# EAGLE design Striptease-Teensy4.1-v1.2 (EAGLE 9.6.2)
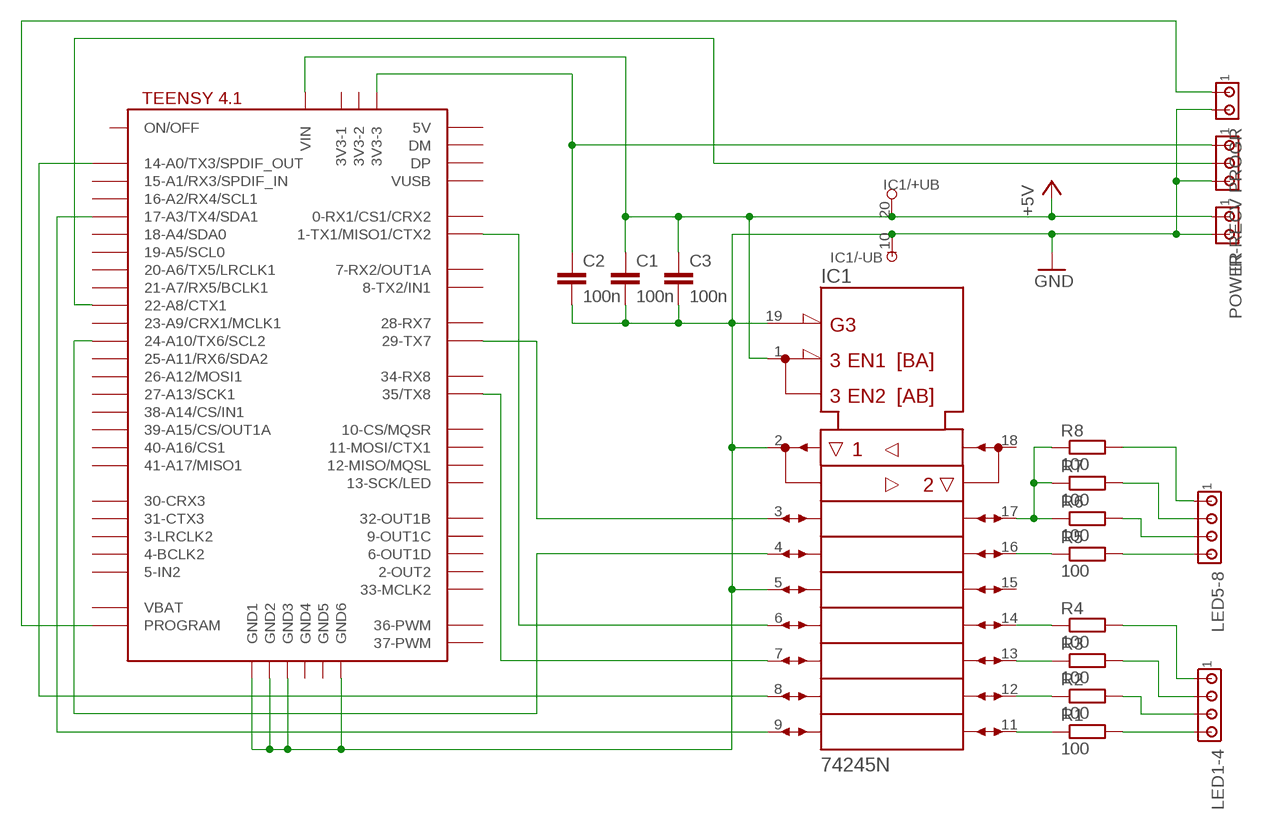
[diagram p0: schematic, sheet 1]

## Parts
C1  100n  C-EU050-025X075  [C050-025X075]
C2  100n  C-EU050-025X075  [C050-025X075]
C3  100n  C-EU050-025X075  [C050-025X075]
IC1  74245N  [DIL20]
IR-RECV  MTA03-100  [10X03MTA]
LED1-4  MTA04-100  [10X04MTA]
LED5-8  MTA04-100  [10X04MTA]
POWER  MTA02-100  [10X02MTA]
PROGR  MTA02-100  [10X02MTA]
R1  100  R-EU_0207/10  [0207/10]
R2  100  R-EU_0207/10  [0207/10]
R3  100  R-EU_0207/10  [0207/10]
R4  100  R-EU_0207/10  [0207/10]
R5  100  R-EU_0207/10  [0207/10]
R6  100  R-EU_0207/10  [0207/10]
R7  100  R-EU_0207/10  [0207/10]
R8  100  R-EU_0207/10  [0207/10]
U$3  TEENSY41-E  [TENNSY41-E]

## Nets
+5V: C1.1 C3.1 IC1.1(DIR) IC1.20(+UB) POWER.1 U$3.VIN
GND: C1.2 C2.2 C3.2 IC1.2(A1) IC1.5(A4) IC1.10(-UB) IC1.19(!G) IR-RECV.3 POWER.2 PROGR.2 U$3.GND1 U$3.GND2 U$3.GND3 U$3.GND6
N$1: C2.1 IR-RECV.1 U$3.3V3-3
N$2: PROGR.1 U$3.PROGRAM
N$3: IC1.16(B3) R5.1
N$6: LED5-8.2 R7.2
N$7: LED1-4.2 R3.2
N$8: LED1-4.3 R2.2
N$9: LED1-4.4 R1.2
N$10: LED5-8.1 R8.2
N$11: IC1.11(B8) R1.1
N$12: IC1.12(B7) R2.1
N$13: IC1.13(B6) R3.1
N$14: IC1.17(B2) R6.1 R7.1 R8.1
N$16: IC1.14(B5) R4.1
N$19: LED1-4.1 R4.2
N$20: LED5-8.4 R5.2
N$22: LED5-8.3 R6.2
N$23: IC1.9(A8) U$3.17-A3/TX4/SDA1
N$24: IC1.8(A7) U$3.14-A0/TX3/SPDIF_OUT
N$25: IC1.7(A6) U$3.35-TX8(35/TX8)
N$26: IC1.6(A5) U$3.1-TX1/MISO1/CTX2
N$27: IC1.4(A3) U$3.24-A10/TX6/SCL2
N$28: IC1.3(A2) U$3.29-TX7
N$31: IR-RECV.2 U$3.22-A8/CTX1
Unconnected: IC1.15(B4) IC1.18(B1) U$3.0-RX1/CS1/CRX2 U$3.2-OUT2 U$3.3-LRCLK2 U$3.3V3-1 U$3.3V3-2 U$3.4-BCLK2 U$3.5-IN2 U$3.6-OUT1D U$3.7-RX2/OUT1A U$3.8-TX2/IN1 U$3.9-OUT1C U$3.10-CS\MQSR(10-CS/MQSR) U$3.11-MOSI/CTX1 U$3.12-MISO/MQSL U$3.13-SCK/LED U$3.15-A1/RX3/SPDIF_IN U$3.16-A2/RX4/SCL1 U$3.18-A4/SDA0 U$3.19-A5/SCL0 U$3.20-A6/TX5/LRCLK1 U$3.21-A7/RX5/BCLK1 U$3.23-A9/CRX1/MCLK1 U$3.25-A11/RX6/SDA2 U$3.26-A12/MOSI1 U$3.27-A13/SCK1 U$3.28-RX7 U$3.30-CRX3 U$3.31-CTX3 U$3.32-OUT1B U$3.33-MCLK2 U$3.34-RX8 U$3.36-PWM U$3.37-PWM U$3.38-A14/CS/IN1 U$3.39-A15/CS/OUT1A U$3.40-A16/CS1 U$3.41-A17/MISO1 U$3.+5V(5V) U$3.DM U$3.DP U$3.GND4 U$3.GND5 U$3.ON/OFF U$3.VBAT U$3.VUSB

## Library data of the parts
C1-C3 = rcl:C-EU: CAPACITOR, European symbol; SPICEPREFIX: C
IC1 = 74ttl-din:74*245: Octal BUS TRANSCEIVER, 3-state
IR-RECV = con-amp:MTA03-100: AMP connector
LED1-4 LED5-8 = con-amp:MTA04-100: AMP connector
POWER PROGR = con-amp:MTA02-100: AMP connector
R1-R8 = rcl:R-EU_: RESISTOR, European symbol; SPICEPREFIX: R
U$3 = teensy:TEENSY41-E

## Board
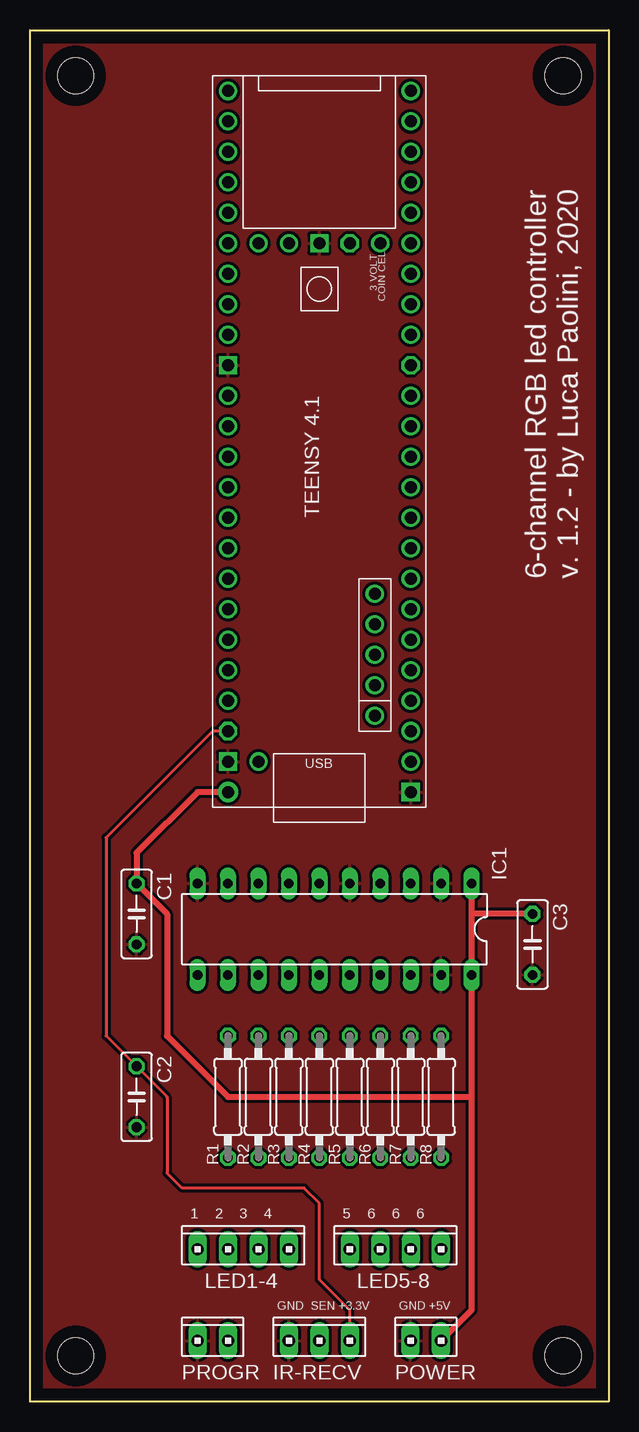
[diagram p1: board, top side]
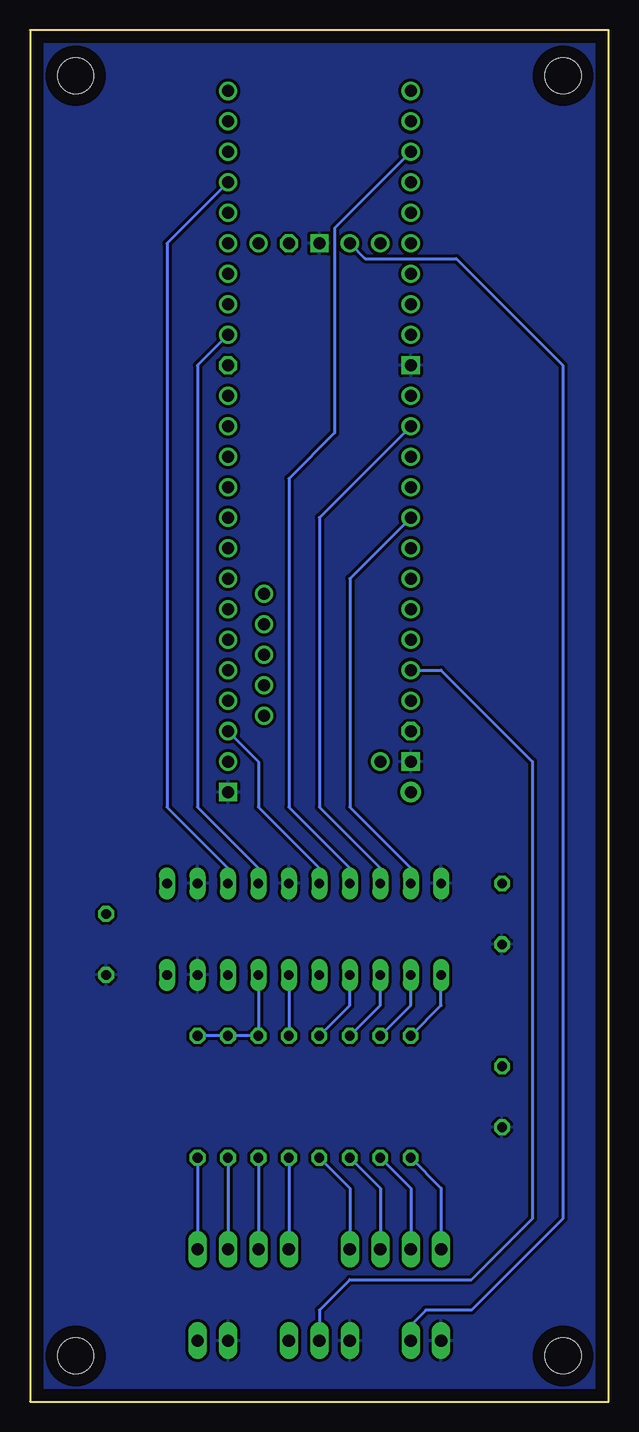
[diagram p2: board, bottom side, seen from below]

Size 48.26 x 114.3 mm. Coordinates in mm from the lower left corner, seen from the top.
Outline: 0,114.3 48.26,114.3 48.26,0 0,0 0,114.3
Copper layers (1*16): Top 0.035mm / dielectric 1.5mm / Bottom 0.035mm
Design rules "default *": minimum track width 6mil, minimum drill 0.35mm, track to track 10mil, track to pad 10mil, pad to pad 10mil, via to via 10mil, smd to smd 6mil, copper to edge 40mil, drill to drill 6mil, minimum pad ring 10mil, minimum via ring 8mil, stop-mask expansion 4mil, vias tented up to drill 0mil, thermal gap 10mil
Holes 3 mm at 44.45,110.49 3.81,110.49 3.81,3.81 44.45,3.81

### Footprints (pad centres in the part's own frame; a part is rotated, then mirrored left to right if it is on the bottom)
C050-025X075 = drill 0.813 octagon: 1 -2.54,0; 2 2.54,0
DIL20 = drill 0.813 long: 1 -11.43,-3.81; 2 -8.89,-3.81; 3 -6.35,-3.81; 4 -3.81,-3.81; 5 -1.27,-3.81; 6 1.27,-3.81; 7 3.81,-3.81; 8 6.35,-3.81; 9 8.89,-3.81; 10 11.43,-3.81; 11 11.43,3.81; 12 8.89,3.81; 13 6.35,3.81; 14 3.81,3.81; 15 1.27,3.81; 16 -1.27,3.81; 17 -3.81,3.81; 18 -6.35,3.81; 19 -8.89,3.81; 20 -11.43,3.81
10X03MTA = drill 1.016 long: 1 2.54,0; 2 0,0; 3 -2.54,0
10X04MTA = drill 1.016 long: 1 3.81,0; 2 1.27,0; 3 -1.27,0; 4 -3.81,0
10X02MTA = drill 1.016 long: 1 1.27,0; 2 -1.27,0
0207/10 = drill 0.813 octagon: 1 -5.08,0; 2 5.08,0
TENNSY41-E = drill 1: 0-RX1/CS1/CRX2 -27.94,-7.62; 1-TX1/MISO1/CTX2 -25.4,-7.62; 2-OUT2 -22.86,-7.62; 3-LRCLK2 -20.32,-7.62; 4-BCLK2 -17.78,-7.62; 5-IN2 -15.24,-7.62; 6-OUT1D -12.7,-7.62; 7-RX2/OUT1A -10.16,-7.62; 8-TX2/IN1 -7.62,-7.62; 9-OUT1C -5.08,-7.62; 10-CS\MQSR -2.54,-7.62; 11-MOSI/CTX1 0,-7.62; 12-MISO/MQSL 2.54,-7.62; 13-SCK/LED 2.54,7.62; 14-A0/TX3/SPDIF_OUT 0,7.62; 15-A1/RX3/SPDIF_IN -2.54,7.62; 16-A2/RX4/SCL1 -5.08,7.62; 17-A3/TX4/SDA1 -7.62,7.62; 18-A4/SDA0 -10.16,7.62; 19-A5/SCL0 -12.7,7.62; 20-A6/TX5/LRCLK1 -15.24,7.62; 21-A7/RX5/BCLK1 -17.78,7.62; 22-A8/CTX1 -20.32,7.62; 23-A9/CRX1/MCLK1 -22.86,7.62; 24-A10/TX6/SCL2 7.62,-7.62; 25-A11/RX6/SDA2 10.16,-7.62; 26-A12/MOSI1 12.7,-7.62; 27-A13/SCK1 15.24,-7.62; 28-RX7 17.78,-7.62; 29-TX7 20.32,-7.62; 30-CRX3 22.86,-7.62; 31-CTX3 25.4,-7.62; 32-OUT1B 27.94,-7.62; 33-MCLK2 27.94,7.62; 34-RX8 25.4,7.62; 35-TX8 22.86,7.62; 36-PWM 20.32,7.62; 37-PWM 17.78,7.62; 38-A14/CS/IN1 15.24,7.62; 39-A15/CS/OUT1A 12.7,7.62; 40-A16/CS1 10.16,7.62; 41-A17/MISO1 7.62,7.62; +5V -24.13,-4.62; DM -21.59,-4.62; DP -19.05,-4.62; GND4 -16.51,-4.62; GND5 -13.97,-4.62; ON/OFF 15.24,5.08; PROGRAM 15.24,2.54; VBAT 15.24,-5.08; VUSB -27.94,5.08 | drill 1 octagon: 3V3-1 5.08,-7.62; 3V3-2 15.24,-2.54; 3V3-3 -25.4,7.62 | drill 1 square: GND1 -30.48,-7.62; GND2 15.24,0; GND3 5.08,7.62; GND6 -27.94,7.62 | drill 1 pad 1.676: VIN -30.48,7.62

### Placement (x,y rotation side)
C1  8.89,40.64 270 top
C2  8.89,25.4 270 top
C3  41.91,38.1 270 top
IC1  25.4,39.37 180 top
IR-RECV  24.13,5.08 0 top
LED1-4  17.78,12.7 0 top
LED5-8  30.48,12.7 0 top
POWER  33.02,5.08 0 top
PROGR  15.24,5.08 0 top
R1  16.51,25.4 270 top
R2  19.05,25.4 270 top
R3  21.59,25.4 270 top
R4  24.13,25.4 270 top
R5  26.67,25.4 270 top
R6  29.21,25.4 270 top
R7  31.75,25.4 270 top
R8  34.29,25.4 270 top
U$3  24.13,81.28 90 top

### Tracks (layer width: path | path; a pad name or v marks a point on that pad's centre or on a via)
+5V
  Top 0.508: IC1.1 IC1.20 | 36.83,25.4 16.51,25.4 11.43,30.48 11.43,40.64 C1.1 8.89,45.72 13.97,50.8 U$3.VIN | 36.83,25.4 36.83,7.62 POWER.1 | IC1.20 36.83,25.4 | C3.1 36.83,40.64 IC1.20
GND
  pour Bottom: 0,114.3 48.26,114.3 48.26,0 0,0
  pour Top: 0,114.3 48.26,114.3 48.26,0 0,0
N$1
  Top 0.254: U$3.3V3-3 15.24,55.88 6.35,46.99 6.35,30.48 C2.1 11.43,25.4 11.43,19.05 12.7,17.78 22.86,17.78 24.13,16.51 24.13,10.16 26.67,7.62 IR-RECV.1
N$2
  Bottom 0.254: U$3.PROGRAM 20.32,95.25 12.7,95.25 3.81,86.36 3.81,15.24 11.43,7.62 15.24,7.62 16.51,6.35 PROGR.1
N$3
  Bottom 0.254: IC1.16 R5.1
N$6
  Bottom 0.254: R7.2 LED5-8.2
N$7
  Bottom 0.254: R3.2 19.05,17.78 LED1-4.2
N$8
  Bottom 0.254: R2.2 16.51,17.78 LED1-4.3
N$9
  Bottom 0.254: R1.2 13.97,17.78 LED1-4.4
N$10
  Bottom 0.254: R8.2 LED5-8.1
N$11
  Bottom 0.254: R1.1 13.97,33.02 IC1.11
N$12
  Bottom 0.254: R2.1 16.51,33.02 IC1.12
N$13
  Bottom 0.254: R3.1 19.05,33.02 IC1.13
N$14
  Bottom 0.254: IC1.17 R6.1 R7.1 R8.1
N$16
  Bottom 0.254: R4.1 21.59,33.02 IC1.14
N$19
  Bottom 0.254: R4.2 21.59,17.78 LED1-4.1
N$20
  Bottom 0.254: R5.2 LED5-8.4
N$22
  Bottom 0.254: R6.2 LED5-8.3
N$23
  Bottom 0.254: IC1.9 16.51,44.45 21.59,49.53 21.59,68.58 U$3.17-A3/TX4/SDA1
N$24
  Bottom 0.254: IC1.8 19.05,44.45 24.13,49.53 24.13,73.66 U$3.14-A0/TX3/SPDIF_OUT
N$25
  Bottom 0.254: IC1.7 21.59,44.45 26.67,49.53 26.67,76.91 22.86,80.72 22.86,97.79 U$3.35-TX8
N$26
  Bottom 0.254: IC1.6 24.13,44.45 29.21,49.53 29.21,53.34 U$3.1-TX1/MISO1/CTX2
N$27
  Bottom 0.254: IC1.4 29.21,44.45 34.29,49.53 34.29,86.36 U$3.24-A10/TX6/SCL2
N$28
  Bottom 0.254: IC1.3 31.75,44.45 36.83,49.53 36.83,96.52 U$3.29-TX7
N$31
  Bottom 0.254: U$3.22-A8/CTX1 13.97,60.96 6.35,53.34 6.35,15.24 11.43,10.16 21.59,10.16 24.13,7.62 IR-RECV.2

### Text on the board
tNames: 6-channel RGB led controller / v. 1.2 - by Luca Paolini, 2020 | 1 2 3 4 | 5 6 6 6 | GND SEN +3.3V | GND +5V